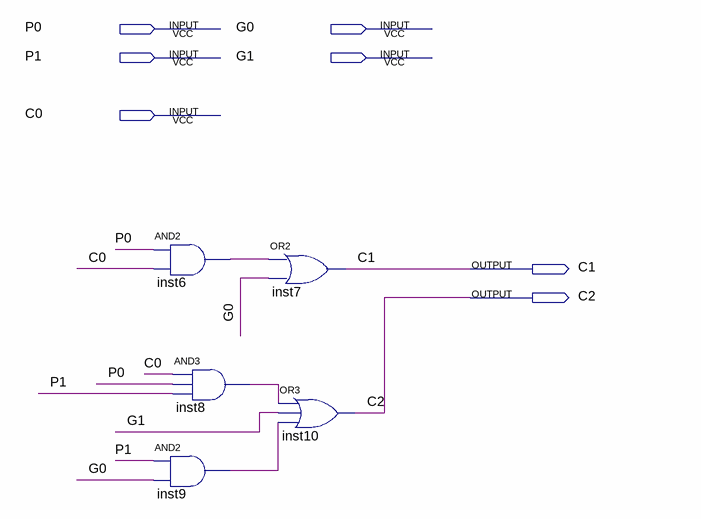
[diagram p0: schematic sheet]
// Quartus schematic CLG2.bdf as structural Verilog: 5 symbols, 7 pins
module CLG2 (
  input  P0,
  input  G0,
  input  P1,
  input  G1,
  input  C0,
  output C1,
  output C2
);

  wire inst6_out, inst8_out, inst9_out;

  and inst6 (inst6_out, P0, C0);
  and inst9 (inst9_out, P1, G0);
  and inst8 (inst8_out, C0, P0, P1);
  or inst7 (C1, inst6_out, G0);
  or inst10 (C2, inst8_out, G1, inst9_out);
endmodule
